# Altium schematic sheet OLD THINGS.SchDoc
size A4
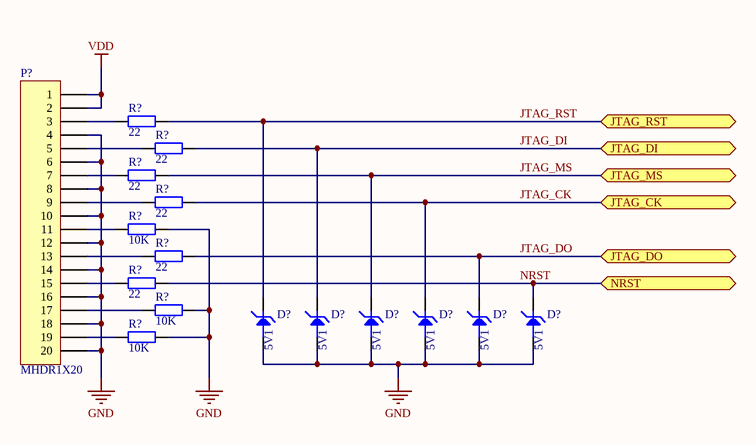
[diagram p0: OLD THINGS.SchDoc]

## Parts
(Parts that share a designator on the sheet are numbered #1, #2 ... from top to bottom, then left to right.)
D?#1  5V1  [SOT23]
D?#2  5V1  [SOT23]
D?#3  5V1  [SOT23]
D?#4  5V1  [SOT23]
D?#5  5V1  [SOT23]
D?#6  5V1  [SOT23]
P?  MHDR1X20  [MHDR1X20]
R?#1  22  [0603]
R?#2  22  [0603]
R?#3  22  [0603]
R?#4  22  [0603]
R?#5  10K  [0603]
R?#6  22  [0603]
R?#7  22  [0603]
R?#8  10K  [0603]
R?#9  10K  [0603]

## Ports
JTAG_CK, JTAG_DI, JTAG_DO, JTAG_MS, JTAG_RST, NRST

## Nets
GND: D?#1.1 D?#2.1 D?#3.1 D?#4.1 D?#5.1 D?#6.1 P?.4 P?.6 P?.8 P?.10 P?.12 P?.14 P?.16 P?.18 P?.20 R?#5.2 R?#8.2 R?#9.2
VDD: P?.1 P?.2
JTAG_CK: D?#4.3 R?#4.2 ; port JTAG_CK
JTAG_DI: D?#2.3 R?#2.2 ; port JTAG_DI
JTAG_DO: D?#5.3 R?#6.2 ; port JTAG_DO
JTAG_MS: D?#3.3 R?#3.2 ; port JTAG_MS
JTAG_RST: D?#1.3 R?#1.2 ; port JTAG_RST
NRST: D?#6.3 R?#7.2 ; port NRST
NetP?_3: P?.3 R?#1.1
NetP?_5: P?.5 R?#2.1
NetP?_7: P?.7 R?#3.1
NetP?_9: P?.9 R?#4.1
NetP?_11: P?.11 R?#5.1
NetP?_13: P?.13 R?#6.1
NetP?_15: P?.15 R?#7.1
NetP?_17: P?.17 R?#8.1
NetP?_19: P?.19 R?#9.1

## Library data of the parts
D?#1-D?#6 = DZ_5V1_MMBZ5231B: Supplier 1: Mouser; Supplier Part Number 1: 863-SZMMBZ5231BLT3G
P? = MHDR1X20: Header, 20-Pin; LatestRevisionDate: 17-Jul-2002; LatestRevisionNote: Re-released for DXP Platform.; Publisher: Altium Limited
R?#1-R?#4 R?#6 R?#7 = R_0603_025W_22Ohm: 0.25W 22Ohm; LatestRevisionDate: 17-Jul-2002; LatestRevisionNote: Re-released for DXP Platform.; PackageReference: AXIAL-0.4; PackageDescription: Axial Device, Thru-Hole; 2 Leads; 0.4 in Pin Spacing; Supplier 1: Mouser; Supplier Part Number 1: 667-ERJ-PA3J220V
R?#5 R?#8 R?#9 = R_0603_01W_10K: 0.1W 10K; Supplier 1: Mouser; Supplier Part Number 1: 667-ERJ-3GEYJ103V